# EAGLE design 7 segment Arduino Shield (EAGLE 9.6.2)
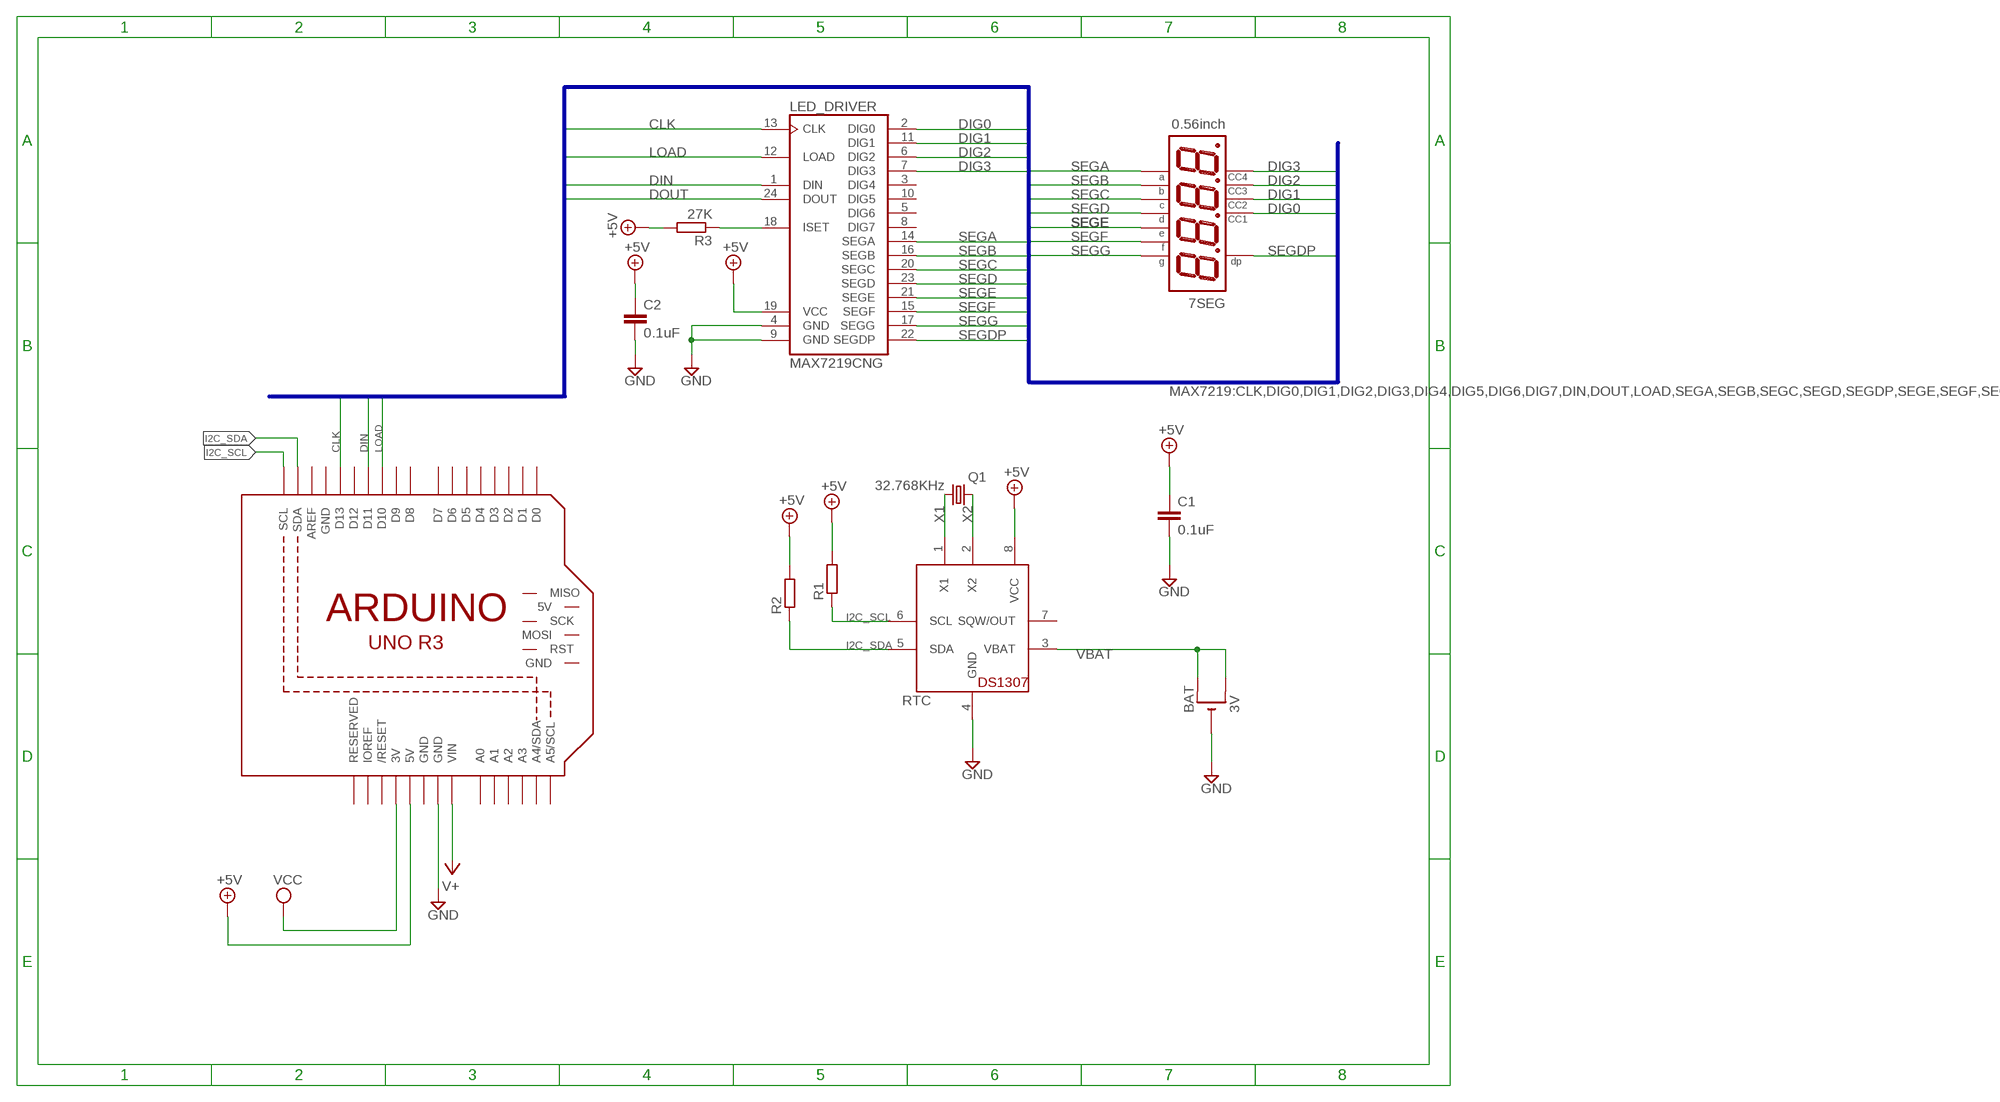
[diagram p0: schematic, sheet 1]

## Parts
7SEG  0.56inch  NFD-5641AS  [NFD-5641]
BAT  3V  CR1220SMT  [CR1220-SMD]
C1  0.1uF  C-EU050-030X075  [C050-030X075]
C2  0.1uF  C-EUC1206  [C1206]
LED_DRIVER  MAX7219CNG  [DIL24-3]
M1  ARDUINO_R3_ICSP  [ARDUINOR3_ICSP]
Q1  32.768KHz  CRYSTALTC26H  [TC26H]
R1  R-EU_M1206  [M1206]
R2  R-EU_M1206  [M1206]
R3  27K  R-EU_M1206  [M1206]
RTC  DS1307  [DIL08]

## Nets
+5V [power]: C1.1 C2.1 LED_DRIVER.19(VCC) M1.5V R1.2 R2.2 R3.2 RTC.8(VCC)
CLK [MAX7219 Net]: LED_DRIVER.13(CLK) M1.D13
DIG0 [MAX7219 Net]: 7SEG.P$12 LED_DRIVER.2(DIG0)
DIG1 [MAX7219 Net]: 7SEG.P$9 LED_DRIVER.11(DIG1)
DIG2 [MAX7219 Net]: 7SEG.P$8 LED_DRIVER.6(DIG2)
DIG3 [MAX7219 Net]: 7SEG.P$6 LED_DRIVER.7(DIG3)
DIN [MAX7219 Net]: LED_DRIVER.1(DIN) M1.D11
DOUT [MAX7219 Net]: LED_DRIVER.24(DOUT)
GND [power]: BAT.- C1.2 C2.2 LED_DRIVER.4(GND) LED_DRIVER.9(GND) M1.GND@3(GND) RTC.4(GND)
I2C_SCL: M1.SCL R1.1 RTC.6(SCL)
I2C_SDA: M1.SDA R2.1 RTC.5(SDA)
LOAD [MAX7219 Net]: LED_DRIVER.12(LOAD) M1.D10
N$1: LED_DRIVER.18(ISET) R3.1
SEGA [MAX7219 Net]: 7SEG.P$11 LED_DRIVER.14(SEGA)
SEGB [MAX7219 Net]: 7SEG.P$7 LED_DRIVER.16(SEGB)
SEGC [MAX7219 Net]: 7SEG.P$4 LED_DRIVER.20(SEGC)
SEGD [MAX7219 Net]: 7SEG.P$2 LED_DRIVER.23(SEGD)
SEGDP [MAX7219 Net]: 7SEG.P$3 LED_DRIVER.22(SEGDP)
SEGE [MAX7219 Net]: 7SEG.P$1 LED_DRIVER.21(SEGE)
SEGF [MAX7219 Net]: 7SEG.P$10 LED_DRIVER.15(SEGF)
SEGG [MAX7219 Net]: 7SEG.P$5 LED_DRIVER.17(SEGG)
V+: M1.VIN
VBAT [power]: BAT.+$1(+) BAT.+$2(+1) RTC.3(VBAT)
VCC [power]: M1.3V
X1: Q1.2 RTC.1(X1)
X2: Q1.1 RTC.2(X2)
Unconnected: LED_DRIVER.3(DIG4) LED_DRIVER.5(DIG6) LED_DRIVER.8(DIG7) LED_DRIVER.10(DIG5) M1.5V_ICSP(5V) M1.A0 M1.A1 M1.A2 M1.A3 M1.A4(A4/SDA) M1.A5(A5/SCL) M1.AREF M1.D0 M1.D1 M1.D2 M1.D3 M1.D4 M1.D5 M1.D6 M1.D7 M1.D8 M1.D9 M1.D12 M1.GND@2(GND) M1.IOREF M1.MISO M1.MOSI M1.RESERVED M1.RESET(/RESET) M1.RESET_ICSP(RST) M1.SCK RTC.7(SQW/OUT)

## Buses
MAX7219:CLK,DIG0,DIG1,DIG2,DIG3,DIG4,DIG5,DIG6,DIG7,DIN,DOUT,LOAD,SEGA,SEGB,SEGC,SEGD,SEGDP,SEGE,SEGF,SEGG

## Power pins joined to a net without a drawn wire
GND: M1.GND M1.GND@1(GND)

## Library data of the parts
7SEG = display-nfd:NFD-5641AS: Four Digit 0.56" CC Seven-Segment LED Display Futurlec part number: 7FR5641AS Created by RobG
BAT = adafruit:CR1220: CR1216/CR1220/CR1225 12mm 3V lithium coin cell Great for battery packup. Both SMT and THM holders. Note the THM package has the ground pads on both sides of the PCB so that the masks are the same - this reduces the cost
C1 C2 = rcl:C-EU: CAPACITOR, European symbol; SPICEPREFIX: C
LED_DRIVER = maxim:MAX7219CNG: LED DISPLAY DRIVER; MF: MAXIM; MPN: MAX7219CNG; OC_FARNELL: 1523914; OC_NEWARK: 34C4018
M1 = adafruit:ARDUINO_R3_ICSP
Q1 = adafruit:CRYSTAL: CRYSTAL; OC_FARNELL: unknown; OC_NEWARK: unknown
R1-R3 = rcl:R-EU_: RESISTOR, European symbol; SPICEPREFIX: R
RTC = adafruit:DS1307: DS1307 Real time clock (RTC) with battery backup ability. Talk to it via i2c

## Net classes
0 default: width 0.254 mm, drill 0.406 mm, clearance 0.254 mm
1 MAX7219 Net: width 0.203 mm, drill 0.406 mm, clearance 0.203 mm
2 power: width 0.406 mm, drill 0.406 mm, clearance 0.305 mm

## Board
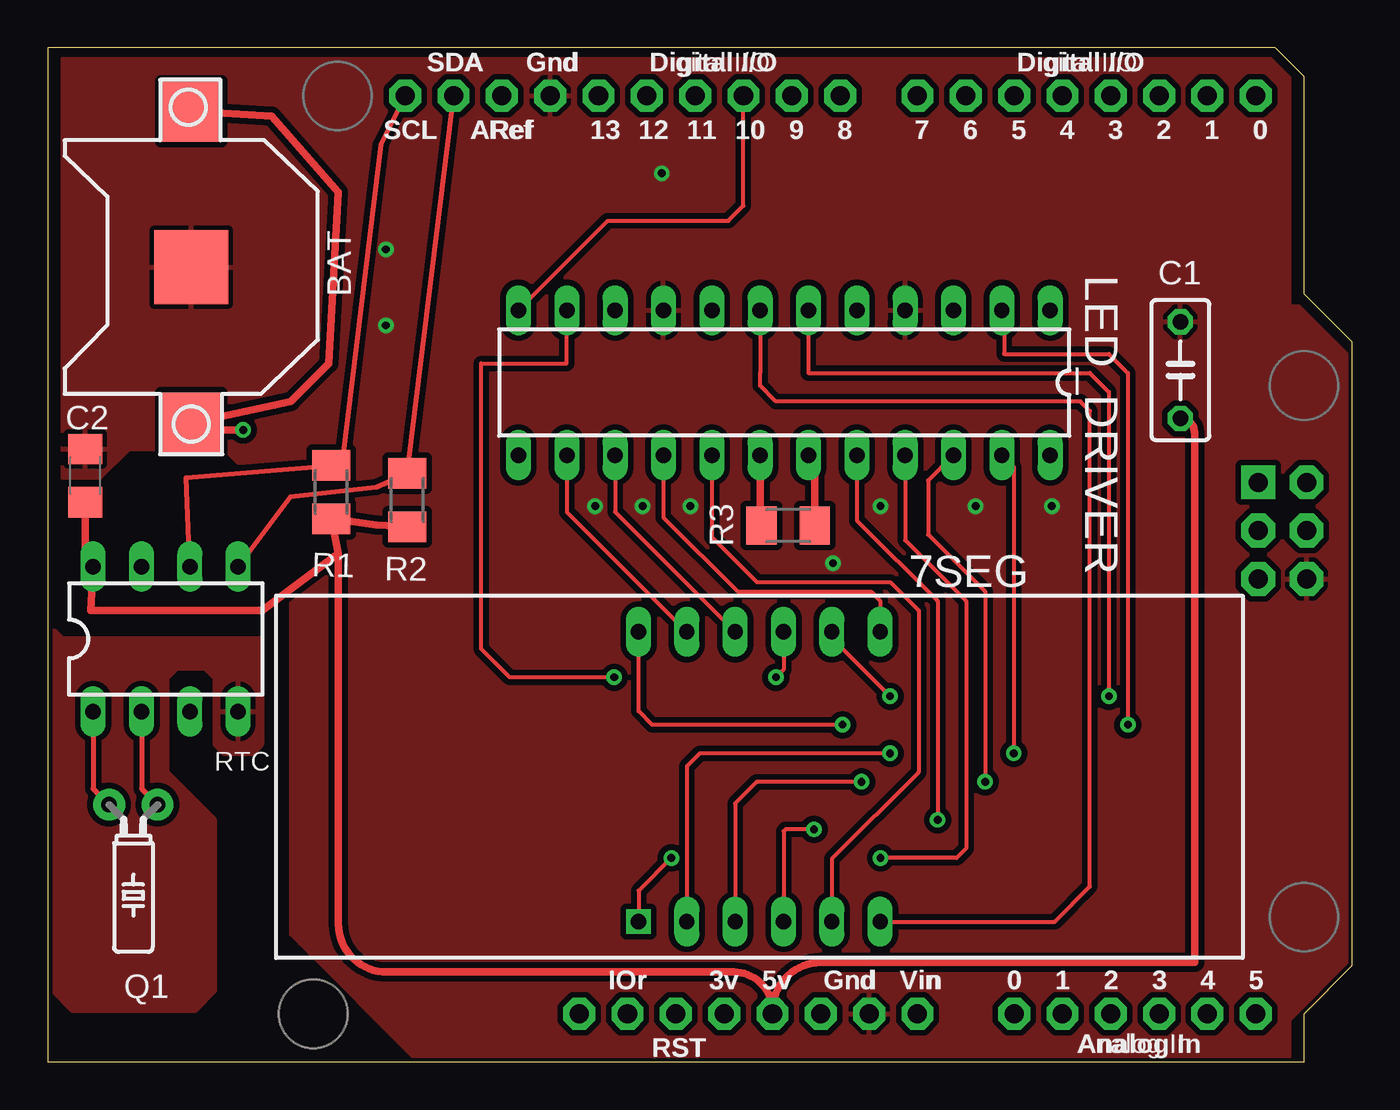
[diagram p1: board, top side]
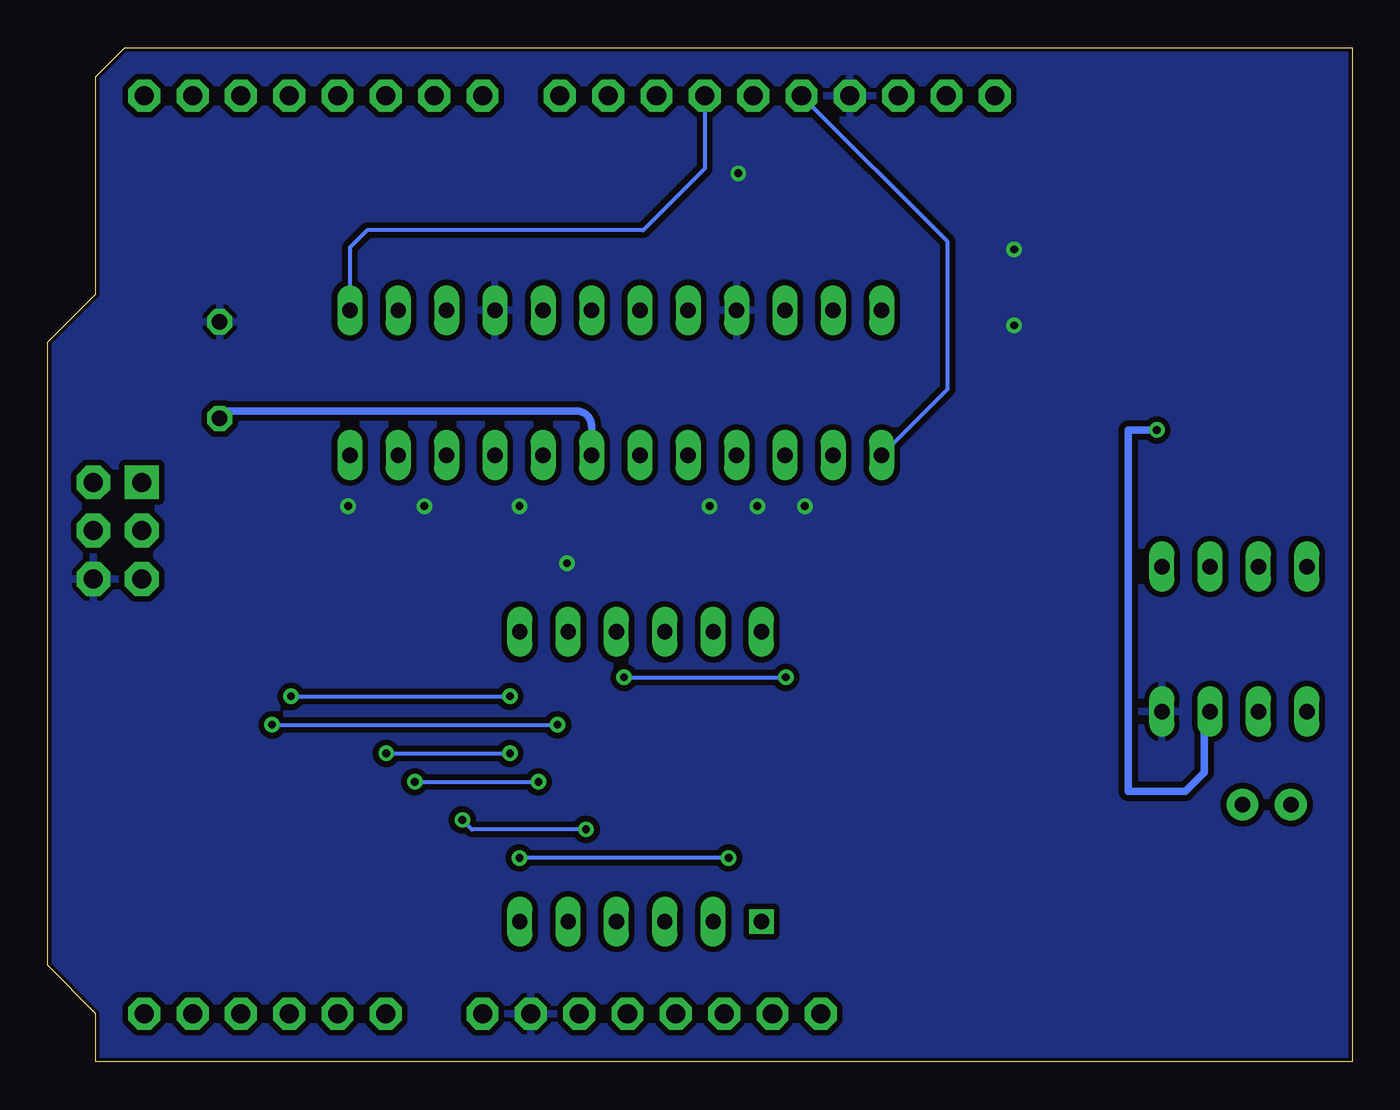
[diagram p2: board, bottom side, seen from below]

Size 68.58 x 53.34 mm. Coordinates in mm from the lower left corner, seen from the top.
Copper layers (1*16): Top 0.035mm / dielectric 1.5mm / Bottom 0.035mm
Design rules "default *": minimum track width 8mil, minimum drill 0.35mm, track to track 8mil, track to pad 8mil, pad to pad 8mil, via to via 8mil, smd to smd 8mil, copper to edge 8mil, drill to drill 6mil, minimum pad ring 10mil, minimum via ring 8mil, stop-mask expansion 4mil, vias tented up to drill 0mil, thermal gap 10mil

### Footprints (pad centres in the part's own frame; a part is rotated, then mirrored left to right if it is on the bottom)
NFD-5641 = drill 0.8 square: P$1 -6.35,-7.62 | drill 0.8 long: P$2 -3.81,-7.62; P$3 -1.27,-7.62; P$4 1.27,-7.62; P$5 3.81,-7.62; P$6 6.35,-7.62; P$7 6.35,7.62; P$8 3.81,7.62; P$9 1.27,7.62; P$10 -1.27,7.62; P$11 -3.81,7.62; P$12 -6.35,7.62
CR1220-SMD = smd 3.2 x 3.2: +$1 -8.2,0; +$2 8.2,0 | smd 3.9 x 3.9: - 0,0
C050-030X075 = drill 0.813 octagon: 1 -2.54,0; 2 2.54,0
C1206 = smd 1.6 x 1.8: 1 -1.4,0; 2 1.4,0
DIL24-3 = drill 0.813 long: 1 -13.97,-3.81; 2 -11.43,-3.81; 3 -8.89,-3.81; 4 -6.35,-3.81; 5 -3.81,-3.81; 6 -1.27,-3.81; 7 1.27,-3.81; 8 3.81,-3.81; 9 6.35,-3.81; 10 8.89,-3.81; 11 11.43,-3.81; 12 13.97,-3.81; 13 13.97,3.81; 14 11.43,3.81; 15 8.89,3.81; 16 6.35,3.81; 17 3.81,3.81; 18 1.27,3.81; 19 -1.27,3.81; 20 -3.81,3.81; 21 -6.35,3.81; 22 -8.89,3.81; 23 -11.43,3.81; 24 -13.97,3.81
ARDUINOR3_ICSP = drill 1 pad 1.676 octagon: 3V 35.56,2.54; 5V 38.1,2.54; A0 50.8,2.54; A1 53.34,2.54; A2 55.88,2.54; A3 58.42,2.54; A4 60.96,2.54; A5 63.5,2.54; AREF 23.876,50.8; D0 63.5,50.8; D1 60.96,50.8; D2 58.42,50.8; D3 55.88,50.8; D4 53.34,50.8; D5 50.8,50.8; D6 48.26,50.8; D7 45.72,50.8; D8 41.656,50.8; D9 39.116,50.8; D10 36.576,50.8; D11 34.036,50.8; D12 31.496,50.8; D13 28.956,50.8; GND 26.416,50.8; GND@1 43.18,2.54; GND@2 40.64,2.54; IOREF 30.48,2.54; RESERVED 27.94,2.54; RESET 33.02,2.54; SCL 18.796,50.8; SDA 21.336,50.8; VIN 45.72,2.54 | drill 1 pad 1.778 octagon: 5V_ICSP 66.167,30.48; GND@3 66.167,25.4; MOSI 66.167,27.94; RESET_ICSP 63.627,25.4; SCK 63.627,27.94 | drill 1 pad 1.778 square: MISO 63.627,30.48
TC26H = drill 0.813 pad 1.676: 1 -1.27,0; 2 1.27,0
M1206 = smd 1.6 x 2: 1 -1.4,0; 2 1.4,0
DIL08 = drill 0.813 long: 1 -3.81,-3.81; 2 -1.27,-3.81; 3 1.27,-3.81; 4 3.81,-3.81; 5 3.81,3.81; 6 1.27,3.81; 7 -1.27,3.81; 8 -3.81,3.81

### Placement (x,y rotation side)
7SEG  37.41,15 0 top
BAT  7.55,41.8 90 top
C1  59.54,36.38 90 top
C2  1.98,30.83 90 top
LED_DRIVER  38.72,35.72 180 top
M1  0,0 0 top
Q1  4.51,13.53 180 top
R1  14.91,29.97 270 top
R2  18.91,29.55 270 top
R3  38.92,28.2 0 top
RTC  6.21,22.24 0 top

### Tracks (layer width: path | path; a pad name or v marks a point on that pad's centre or on a via)
+5V
  Top 0.406: M1.5V 38.1,2.69 | 38.1,2.69 arc-90 40.64,5.23 60.28,5.23 60.28,33.1 arc90 C1.1 | LED_DRIVER.19 arc-90 40.32,31.58 R3.2 | C2.1 1.98,26.47 arc90 RTC.8 2.28,23.73 11.28,23.73 15.28,26.73 | 15.28,26.73 R1.2 17.28,28.23 R2.2 | 15.28,26.73 15.28,7.27 arc90 17.82,4.73 36.06,4.73 arc-90 38.1,2.69
  Bottom 0.406: LED_DRIVER.19 39.99,33.44 arc-90 40.78,34.23 59.15,34.23 arc-90 C1.1
CLK
  Bottom 0.203: LED_DRIVER.13 21.28,35.38 21.28,43.12 M1.D13
DIG0  (via drill 0.41)
  Top 0.203: LED_DRIVER.2 50.28,39.4 50.28,37.23 55.78,37.23 56.78,36.23 v56.78,17.73 | v41.78,17.73 31.78,17.73 31.06,18.45 7SEG.P$12
  Bottom 0.203: v56.78,17.73 v41.78,17.73
DIG1  (via drill 0.41)
  Top 0.203: 7SEG.P$9 38.68,20.63 v38.28,20.23 | v29.78,20.23 24.28,20.23 22.78,21.73 22.78,36.73 27.28,36.73 LED_DRIVER.11
  Bottom 0.203: v38.28,20.23 v29.78,20.23
DIG2  (via drill 0.41)
  Top 0.203: LED_DRIVER.6 39.99,36.23 54.78,36.23 55.78,35.23 v55.78,19.23 | v44.28,19.23 41.22,22.29 7SEG.P$8
  Bottom 0.203: v55.78,19.23 v44.28,19.23
DIG3
  Top 0.203: 7SEG.P$6 52.93,7.38 54.78,9.23 54.78,34.23 54.28,34.73 38.28,34.73 37.45,35.56 37.45,36.23 LED_DRIVER.7
DIN
  Bottom 0.203: M1.D11 34.04,46.97 37.28,43.73 51.78,43.73 52.69,42.82 LED_DRIVER.1
GND  (via drill 0.41)
  other vias: 41.28,26.23 43.78,29.23 48.78,29.23 52.78,29.23 33.78,29.23 31.28,29.23 28.78,29.23 32.28,46.73 17.78,42.73 17.78,38.73
  pour Top (isolate 0.254): 0.28,22.73 0.28,3.73 1.28,2.73 7.78,2.73 8.78,3.73 8.78,12.73 6.28,15.23 6.28,20.23 6.78,20.73 8.28,20.73 8.78,20.23 8.78,16.73 9.28,16.23 10.78,16.23 11.28,16.73 11.28,22.23 0.78,22.23
  pour Bottom: -0.72,54.23 -0.72,0.23 0.78,-1.27 65.78,-1.27 71.78,4.73 71.78,50.23 64.28,57.73 2.28,57.73 2.28,57.23
  pour Top: 0.78,52.73 0.78,30.73 2.78,30.73 4.28,32.23 9.28,32.23 12.78,28.73 12.78,24.23 12.78,6.73 13.28,6.23 19.28,0.23 65.28,0.23 65.28,2.23 68.28,5.23 68.28,37.23 65.78,39.73 65.28,39.73 65.28,51.73 64.28,52.73 60.78,52.73
I2C_SCL
  Top 0.254: RTC.6 7.28,30.73 R1.1 15.55,32.01 17.52,48.23 M1.SCL
I2C_SDA
  Top 0.254: RTC.5 12.78,29.73 17.28,30.23 R2.1 M1.SDA
LOAD
  Top 0.203: LED_DRIVER.12 29.45,44.23 35.78,44.23 36.58,45.03 M1.D10
N$1
  Top 0.406: LED_DRIVER.18 37.45,28.27 arc90 R3.1
SEGA
  Top 0.203: LED_DRIVER.14 27.29,28.93 7SEG.P$11
SEGB
  Top 0.203: LED_DRIVER.16 32.37,28.64 36.28,24.73 43.28,24.73 43.76,24.25 7SEG.P$7
SEGC  (via drill 0.41)
  Top 0.203: LED_DRIVER.20 42.53,28.48 46.78,24.23 v46.78,12.73 | v40.28,12.23 38.78,12.23 38.68,12.13 7SEG.P$4
  Bottom 0.203: v46.78,12.73 46.28,12.23 v40.28,12.23
SEGD  (via drill 0.41)
  Top 0.203: LED_DRIVER.23 50.78,31.28 v50.78,16.23 | v44.28,16.23 34.28,16.23 33.6,15.55 7SEG.P$2
  Bottom 0.203: v50.78,16.23 v44.28,16.23
SEGDP  (via drill 0.41)
  Top 0.203: LED_DRIVER.22 46.28,30.58 46.28,27.73 49.28,24.73 v49.28,14.73 | v42.78,14.73 37.28,14.73 36.14,13.59 7SEG.P$3
  Bottom 0.203: v49.28,14.73 v42.78,14.73
SEGE  (via drill 0.41)
  Top 0.203: LED_DRIVER.21 45.07,27.44 48.28,24.23 48.28,11.23 47.78,10.73 v43.78,10.73 | v32.78,10.73 31.06,9.01 7SEG.P$1
  Bottom 0.203: v32.78,10.73 v43.78,10.73
SEGF
  Top 0.203: LED_DRIVER.15 29.83,28.93 7SEG.P$10
SEGG
  Top 0.203: LED_DRIVER.17 34.91,27.6 37.28,25.23 44.28,25.23 45.78,23.73 45.78,15.23 41.22,10.67 7SEG.P$5
VBAT  (via drill 0.41)
  Top 0.406: v10.28,33.23 7.92,33.23 BAT.+$1 12.78,34.73 14.78,36.73 15.28,45.73 11.78,49.73 BAT.+$2
  Bottom 0.406: v10.28,33.23 11.78,33.23 11.78,14.23 8.78,14.23 7.78,15.23 7.78,18.13 RTC.3
X1
  Top 0.254: RTC.1 2.4,14.37 Q1.2
X2
  Top 0.254: RTC.2 4.94,14.37 Q1.1

### Text on the board
_tplace: SDA | Gnd | Digital I/O | Digital I/O | 13 | 12 | 11 | 10 | 9 | 8 | 7 | 6 | 5 | 4 | 3 | 2 | 1 | 0 | SCL | ARef | IOr | 3v | 5v | Gnd | Vin | 0 | 1 | 2 | 3 | 4 | 5 | RST | Analog In